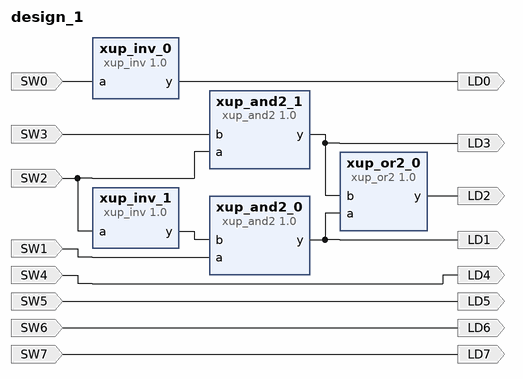
[diagram p0: block diagram of the top level]
# Vivado block design design_1, Vivado 2014.4
create_bd_design design_1

create_bd_port -dir I SW0
create_bd_port -dir O LD0
create_bd_port -dir O LD1
create_bd_port -dir O LD3
create_bd_port -dir I SW1
create_bd_port -dir I SW2
create_bd_port -dir I SW3
create_bd_port -dir O LD2
create_bd_port -dir I SW4
create_bd_port -dir O LD4
create_bd_port -dir I SW5
create_bd_port -dir O LD5
create_bd_port -dir I SW6
create_bd_port -dir O LD6
create_bd_port -dir I SW7
create_bd_port -dir O LD7

create_bd_cell -type ip -vlnv xilinx.com:xup:xup_inv:1.0 xup_inv_0
create_bd_cell -type ip -vlnv xilinx.com:xup:xup_and2:1.0 xup_and2_0
create_bd_cell -type ip -vlnv xilinx.com:xup:xup_and2:1.0 xup_and2_1
create_bd_cell -type ip -vlnv xilinx.com:xup:xup_inv:1.0 xup_inv_1
create_bd_cell -type ip -vlnv xilinx.com:xup:xup_or2:1.0 xup_or2_0

# ---- connections ----

connect_bd_net -net SW0_1 [get_bd_ports SW0] [get_bd_pins xup_inv_0/a]
connect_bd_net [get_bd_pins xup_inv_0/y] [get_bd_ports LD0]
connect_bd_net [get_bd_pins xup_and2_0/y] [get_bd_ports LD1] [get_bd_pins xup_or2_0/a]
connect_bd_net [get_bd_pins xup_and2_1/y] [get_bd_ports LD3] [get_bd_pins xup_or2_0/b]
connect_bd_net -net SW1_1 [get_bd_ports SW1] [get_bd_pins xup_and2_0/a]
connect_bd_net [get_bd_pins xup_inv_1/y] [get_bd_pins xup_and2_0/b]
connect_bd_net -net SW2_1 [get_bd_ports SW2] [get_bd_pins xup_inv_1/a] [get_bd_pins xup_and2_1/a]
connect_bd_net -net SW3_1 [get_bd_ports SW3] [get_bd_pins xup_and2_1/b]
connect_bd_net [get_bd_pins xup_or2_0/y] [get_bd_ports LD2]
connect_bd_net -net SW4_1 [get_bd_ports SW4] [get_bd_ports LD4]
connect_bd_net -net SW5_1 [get_bd_ports SW5] [get_bd_ports LD5]
connect_bd_net -net SW6_1 [get_bd_ports SW6] [get_bd_ports LD6]
connect_bd_net -net SW7_1 [get_bd_ports SW7] [get_bd_ports LD7]

validate_bd_design
save_bd_design
